# EAGLE schematic PICkit3 Extender (EAGLE 6.3)
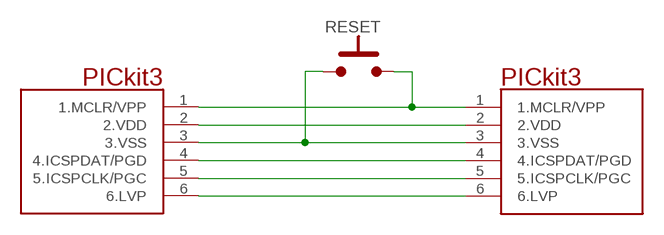
[diagram p0: schematic, sheet 1]

## Parts
RESET  PUSHBUTTON  [TL1105]
U$1  PICKIT3  [PINS_6_PICKIT3]
U$3  PICKIT3PLAIN  [PINS_6]

## Nets
N$1: RESET.2 RESET.4 U$1.1(1.MCLR/VPP) U$3.1(1.MCLR/VPP)
N$2: U$1.2(2.VDD) U$3.2(2.VDD)
N$3: RESET.1 RESET.3 U$1.3(3.VSS) U$3.3(3.VSS)
N$4: U$1.4(4.ICSPDAT/PGD) U$3.4(4.ICSPDAT/PGD)
N$5: U$1.5(5.ICSPCLK/PGC) U$3.5(5.ICSPCLK/PGC)
N$6: U$1.6(6.LVP) U$3.6(6.LVP)

## Library data of the parts
RESET = nolan-utsa:PUSHBUTTON
U$1 U$3 = nolan-utsa:PICKIT3